# Altium schematic sheet 380 PCB Design.SchDoc
size A4
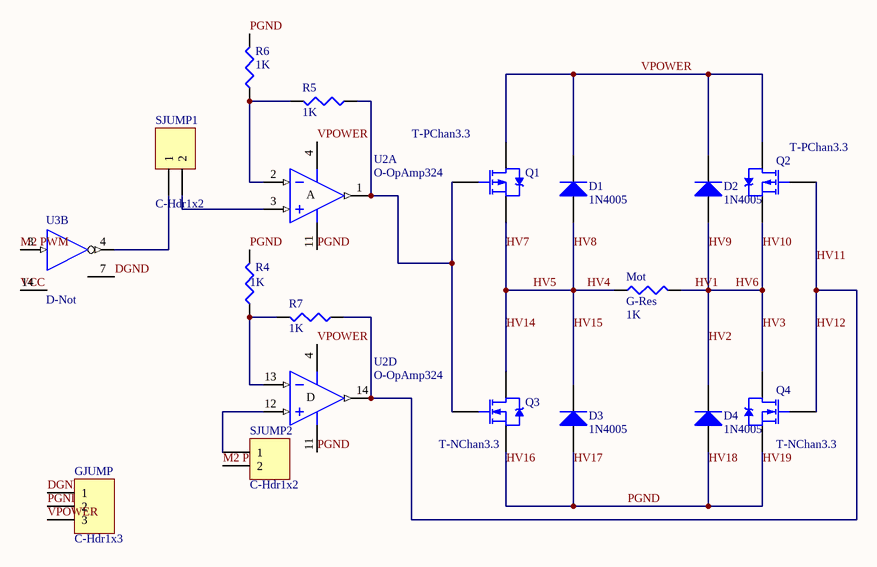
[diagram p0: 380 PCB Design.SchDoc]

## Parts
D1  1N4005  [DO-41_XLGE1.2]
D2  1N4005  [DO-41_XLGE1.2]
D3  1N4005  [DO-41_XLGE1.2]
D4  1N4005  [DO-41_XLGE1.2]
GJUMP  C-Hdr1x3  [HDR1X3_LGE1.0]
Mot  G-Res  value 1K  [Res10mm_LGE1.0]
Q1  T-PChan3.3  [TO-220AB]
Q2  T-PChan3.3  [TO-220AB]
Q3  T-NChan3.3  [TO-220AB]
Q4  T-NChan3.3  [TO-220AB]
R4  1K  [Res10mm_LGE1.0]
R5  1K  [Res10mm_LGE1.0]
R6  1K  [Res10mm_LGE1.0]
R7  1K  [Res10mm_LGE1.0]
SJUMP1  C-Hdr1x2  [HDR1X2_LGE1.0]
SJUMP2  C-Hdr1x2  [HDR1X2_LGE1.0]
U2  O-OpAmp324  [DIP14_LGE1.0]  (parts A,D of 4)
U3  D-Not  [DIP14_LGE1.0]  (part B of 6)

## Nets
DGND: GJUMP.1 U3.7(GND)
HV1: D2.1(A) D4.2(K) Mot.2 Q2.3(S) Q4.2(D)  [also labelled HV10, HV2, HV3, HV6, HV9]
HV11: Q2.1(G) Q4.1(G) R7.1 U2.14(OUT)  [also labelled HV12]
HV14: D1.1(A) D3.2(K) Mot.1 Q1.3(S) Q3.2(D)  [also labelled HV15, HV4, HV5, HV7, HV8]
HV16: D3.1(A) D4.1(A) GJUMP.2 Q3.3(S) Q4.3(S) R4.2 R6.2 U2.11(V-)  [also labelled HV17, HV18, HV19, PGND]
M2 PWM: SJUMP2.2 U3.3(A)
VCC: U3.14(VCC)
VPOWER: D1.2(K) D2.2(K) GJUMP.3 Q1.2(D) Q2.2(D) U2.4(V+)
NetQ1_1: Q1.1(G) Q3.1(G) R5.1 U2.1(OUT)
NetR4_1: R4.1 R7.2 U2.13(IN-)
NetR5_2: R5.2 R6.1 U2.2(IN-)
NetSJUMP1_1: SJUMP1.1 U3.4(Y)
NetSJUMP1_2: SJUMP1.2 U2.3(IN+)
NetSJUMP2_1: SJUMP2.1 U2.12(IN+)

## Notes on the sheet
- (in symbol O-OpAmp324, part A) A
- (in symbol O-OpAmp324, part D) D

## Library data of the parts
D1-D4 = T-Diode-1N4005: diode; Published: 8-Jun-2000; LatestRevisionDate: 17-Jul-2002; LatestRevisionNote: Re-released for DXP Platform.; DatasheetDocument: 1998; PackageDocument: Aug-1999; PackageReference: DO-41; Publisher: Altium Limited; Code_JEDEC: DO-204-AL; ComponentLink1Description: Manufacturer Link; ComponentLink1URL: http://www.fairchildsemi.com/; ComponentLink2Description: Pinout Specification; ComponentLink2URL: http://www.fairchildsemi.com/ds/1N%2F1N4001.pdf
GJUMP = C-Hdr1x3: Header, 4-Pin; LatestRevisionDate: 17-Jul-2002; LatestRevisionNote: Re-released for DXP Platform.; Publisher: Altium Limited
Mot R4-R7 = G-Res: resistor (specify value); Published: 8-Jun-2000; LatestRevisionDate: 29-May-2009; LatestRevisionNote: IPC-7351 Footprint Added.; PackageReference: J1-0603; Publisher: Altium Limited; PackageDescription: Chip Resistor
  R4-R7: Value: 1K
Q1 Q2 = T-PChan3.3: P-Channel Power MOSFET; Note: Pin 4 not drawn and electrically connected to Pin 2.; Published: 4-Nov-2002; PackageReference: TO-220AB; PackageDescription: TO, Thru-Hole, Vertical, Heatsink Mounted; 3 In-Line Leads; Pitch 2.54 mm; ComponentLink1URL: https://www.fairchildsemi.com/products/discretes/fets/mosfets/FQP7P06.html?keyword=FQP7P06
Q3 Q4 = T-NChan3.3: N-Channel Power MOSFET; Note: Pin 2 is electrically connected to pin 4.; Published: 23-Jan-2015; LatestRevisionDate: 23-Jan-2015; PackageReference: TO-220AB; PackageDescription: TO, Thru-Hole, Vertical, Heatsink Mounted; 3 In-Line Leads; Pitch 2.54 mm; ComponentLink1URL: http://www.vishay.com/product?docid=91023#psplib
SJUMP1 SJUMP2 = C-Hdr1x2: Header, 2-Pin; LatestRevisionDate: 17-Jul-2002; LatestRevisionNote: Re-released for DXP Platform.; Publisher: Altium Limited
U2 = O-OpAmp324: quad op-amp; Published: 24-Aug-2001; LatestRevisionDate: 06-Jun-2005; LatestRevisionNote: Stylized 3D Model Added.; DatasheetVersion: Jun-1999; PackageVersion: Jan-1997; PackageReference: DIP14; Publisher: Altium Limited; PackageDescription: DIP; 14 Leads; Row Spacing 7.62 mm; Pitch 2.54 mm; ComponentLink1Description: Manufacturer Link; ComponentLink1URL: http://www.st.com/; ComponentLink2Description: Datasheet; ComponentLink2URL: http://www.st.com/stonline/products/literature/ds/2156/lm324.pdf
U3 = D-Not: hex NOT gate (inverter); Published: 8-Jun-2000; LatestRevisionDate: 04-Mar-2005; LatestRevisionNote: Stylized 3D Model Added.; DatasheetVersion: Mar-1988; PackageVersion: Oct-1995; PackageReference: N014; Publisher: Altium Limited; PackageDescription: DIP; 14 Leads; Row Spacing 7.62 mm; Pitch 2.54 mm; ComponentLink1Description: Manufacturer Link; ComponentLink1URL: http://www.ti.com/; ComponentLink2Description: Datasheet; ComponentLink2URL: http://www-s.ti.com/sc/ds/sn74ls04.pdf